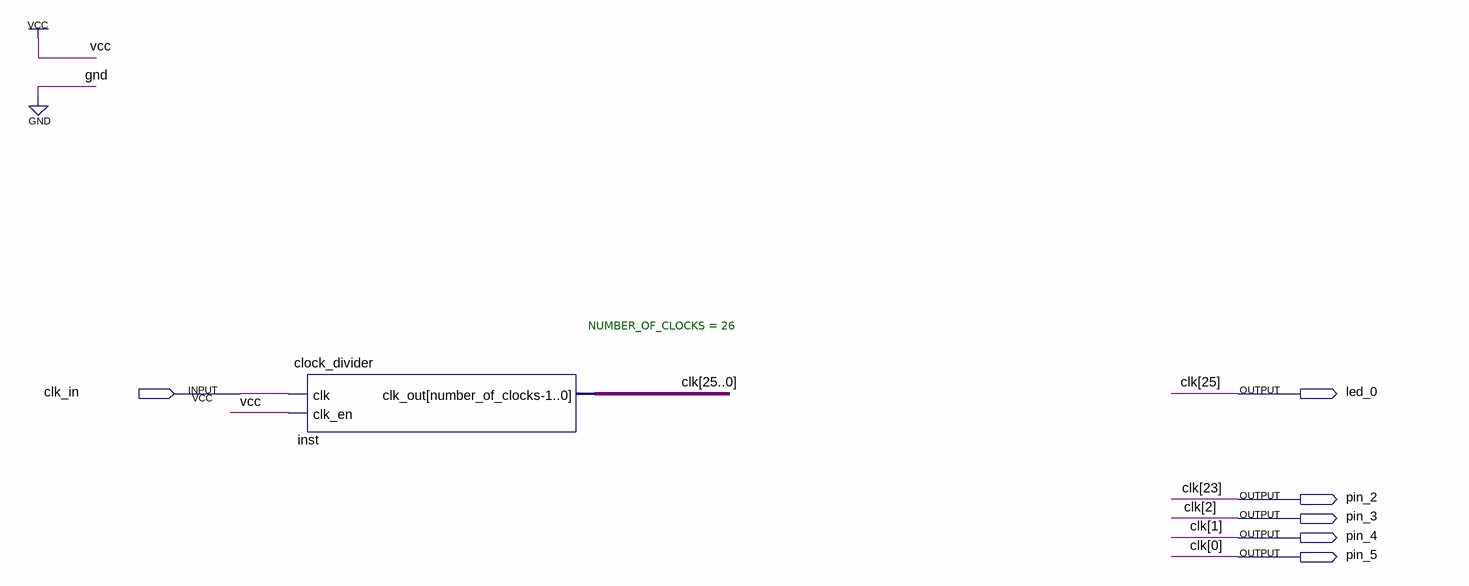
[diagram p0: schematic sheet]
// Quartus schematic epm240_template.bdf as structural Verilog: 1 symbols, 6 pins
module epm240_template (
  input  clk_in,
  output led_0,
  output pin_2,
  output pin_3,
  output pin_4,
  output pin_5
);

  wire [24:3] clk;

  clock_divider #(.NUMBER_OF_CLOCKS(26)) inst (
    .clk(clk_in), .clk_en(1'b1), .clk_out({led_0, clk[24], pin_2, clk[22:3], pin_3, pin_4, pin_5}));

  // Other names for the same wires on the sheet: clk (some bits) = {led_0, pin_2, pin_3, pin_4, pin_5}
endmodule
